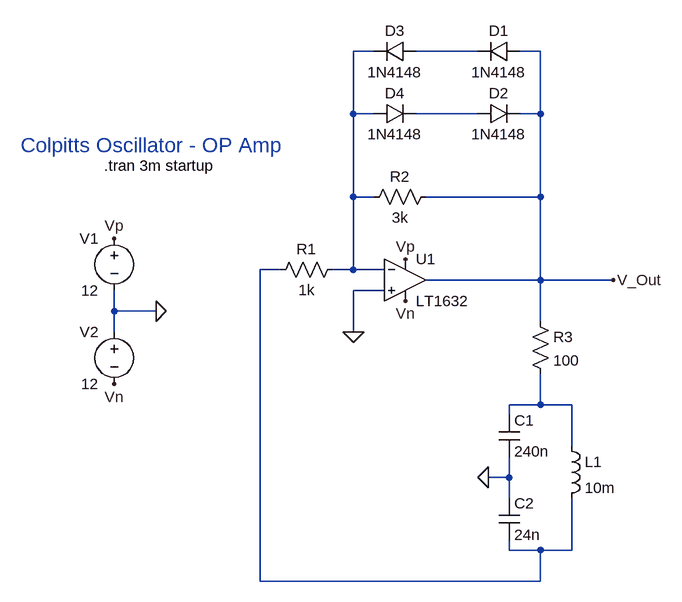
[diagram p0: schematic Colpitts_Op_Amp.asc]
Colpitts_Op_Amp.asc, the LTspice schematic file:
Version 4.1
SHEET 1 880 680
WIRE 96 -304 64 -304
WIRE 256 -304 160 -304
WIRE 352 -304 320 -304
WIRE 64 -208 64 -304
WIRE 96 -208 64 -208
WIRE 256 -208 160 -208
WIRE 352 -208 352 -304
WIRE 352 -208 320 -208
WIRE 64 -80 64 -208
WIRE 96 -80 64 -80
WIRE 352 -80 352 -208
WIRE 352 -80 176 -80
WIRE -48 32 -80 32
WIRE 64 32 64 -80
WIRE 64 32 32 32
WIRE 112 32 64 32
WIRE 352 48 352 -80
WIRE 352 48 176 48
WIRE 464 48 352 48
WIRE 112 64 64 64
WIRE -304 96 -304 64
WIRE -240 96 -304 96
WIRE 352 112 352 48
WIRE -304 128 -304 96
WIRE 64 128 64 64
WIRE 352 240 352 192
WIRE 352 240 304 240
WIRE 400 240 352 240
WIRE 304 256 304 240
WIRE 400 304 400 240
WIRE 304 352 304 320
WIRE 304 352 272 352
WIRE 304 384 304 352
WIRE 304 464 304 448
WIRE 352 464 304 464
WIRE 400 464 400 384
WIRE 400 464 352 464
WIRE -80 512 -80 32
WIRE 352 512 352 464
WIRE 352 512 -80 512
FLAG -240 96 0
FLAG -304 208 Vn
FLAG 144 80 Vn
FLAG -304 -16 Vp
FLAG 144 16 Vp
FLAG 464 48 V_Out
FLAG 64 128 0
FLAG 272 352 0
SYMBOL voltage -304 -32 M0
WINDOW 123 0 0 Left 0
WINDOW 39 0 0 Left 0
SYMATTR InstName V1
SYMATTR Value 12
SYMBOL voltage -304 112 M0
WINDOW 123 0 0 Left 0
WINDOW 39 0 0 Left 0
SYMATTR InstName V2
SYMATTR Value 12
SYMBOL res 48 16 R90
WINDOW 0 0 56 VBottom 2
WINDOW 3 32 56 VTop 2
SYMATTR InstName R1
SYMATTR Value 1k
SYMBOL res 192 -96 R90
WINDOW 0 0 56 VBottom 2
WINDOW 3 32 56 VTop 2
SYMATTR InstName R2
SYMATTR Value 3k
SYMBOL res 336 96 R0
SYMATTR InstName R3
SYMATTR Value 100
SYMBOL cap 288 256 R0
SYMATTR InstName C1
SYMATTR Value 240n
SYMBOL cap 288 384 R0
SYMATTR InstName C2
SYMATTR Value 24n
SYMBOL ind 384 288 R0
SYMATTR InstName L1
SYMATTR Value 10m
SYMATTR SpiceLine Rser=1m
SYMBOL OpAmps\\LT1632 144 -16 R0
SYMATTR InstName U1
SYMBOL diode 320 -320 R90
WINDOW 0 0 32 VBottom 2
WINDOW 3 32 32 VTop 2
SYMATTR InstName D1
SYMATTR Value 1N4148
SYMBOL diode 256 -192 R270
WINDOW 0 32 32 VTop 2
WINDOW 3 0 32 VBottom 2
SYMATTR InstName D2
SYMATTR Value 1N4148
SYMBOL diode 160 -320 R90
WINDOW 0 0 32 VBottom 2
WINDOW 3 32 32 VTop 2
SYMATTR InstName D3
SYMATTR Value 1N4148
SYMBOL diode 96 -192 R270
WINDOW 0 32 32 VTop 2
WINDOW 3 0 32 VBottom 2
SYMATTR InstName D4
SYMATTR Value 1N4148
TEXT -448 -160 Left 3 ;Colpitts Oscillator - OP Amp
TEXT -320 -128 Left 2 !.tran 3m startup

The netlist it stands for:
* Colpitts_Op_Amp.asc
V1 Vp 0 12
V2 0 Vn 12
R1 N001 N004 1k
R2 V_Out N001 3k
R3 V_Out N005 100
C1 N005 0 240n
C2 0 N004 24n
L1 N005 N004 10m Rser=1m
X§U1 0 N001 Vp Vn V_Out LT1632  ; pins In+ In- V+ V- OUT
D1 V_Out N002 1N4148
D2 N003 V_Out 1N4148
D3 N002 N001 1N4148
D4 N001 N003 1N4148
.model D D
.lib standard.dio
* Colpitts Oscillator - OP Amp
.tran 3m startup
.lib LTC.lib
.backanno
.end